# Altium schematic sheet MCU.SchDoc: MCU
size A4; Author: -; CompanyName: IOElectro; DrawnBy: Esmaeill M; Engineer: -; Organization: IOElectro; Address1: Bushehr,Iran; Address2: www.ioelectro.ir; DocumentNumber: 4; Revision: v0.1; SheetNumber: 4; SheetTotal: 6; ProjectNumber: 1013; Note: MCU
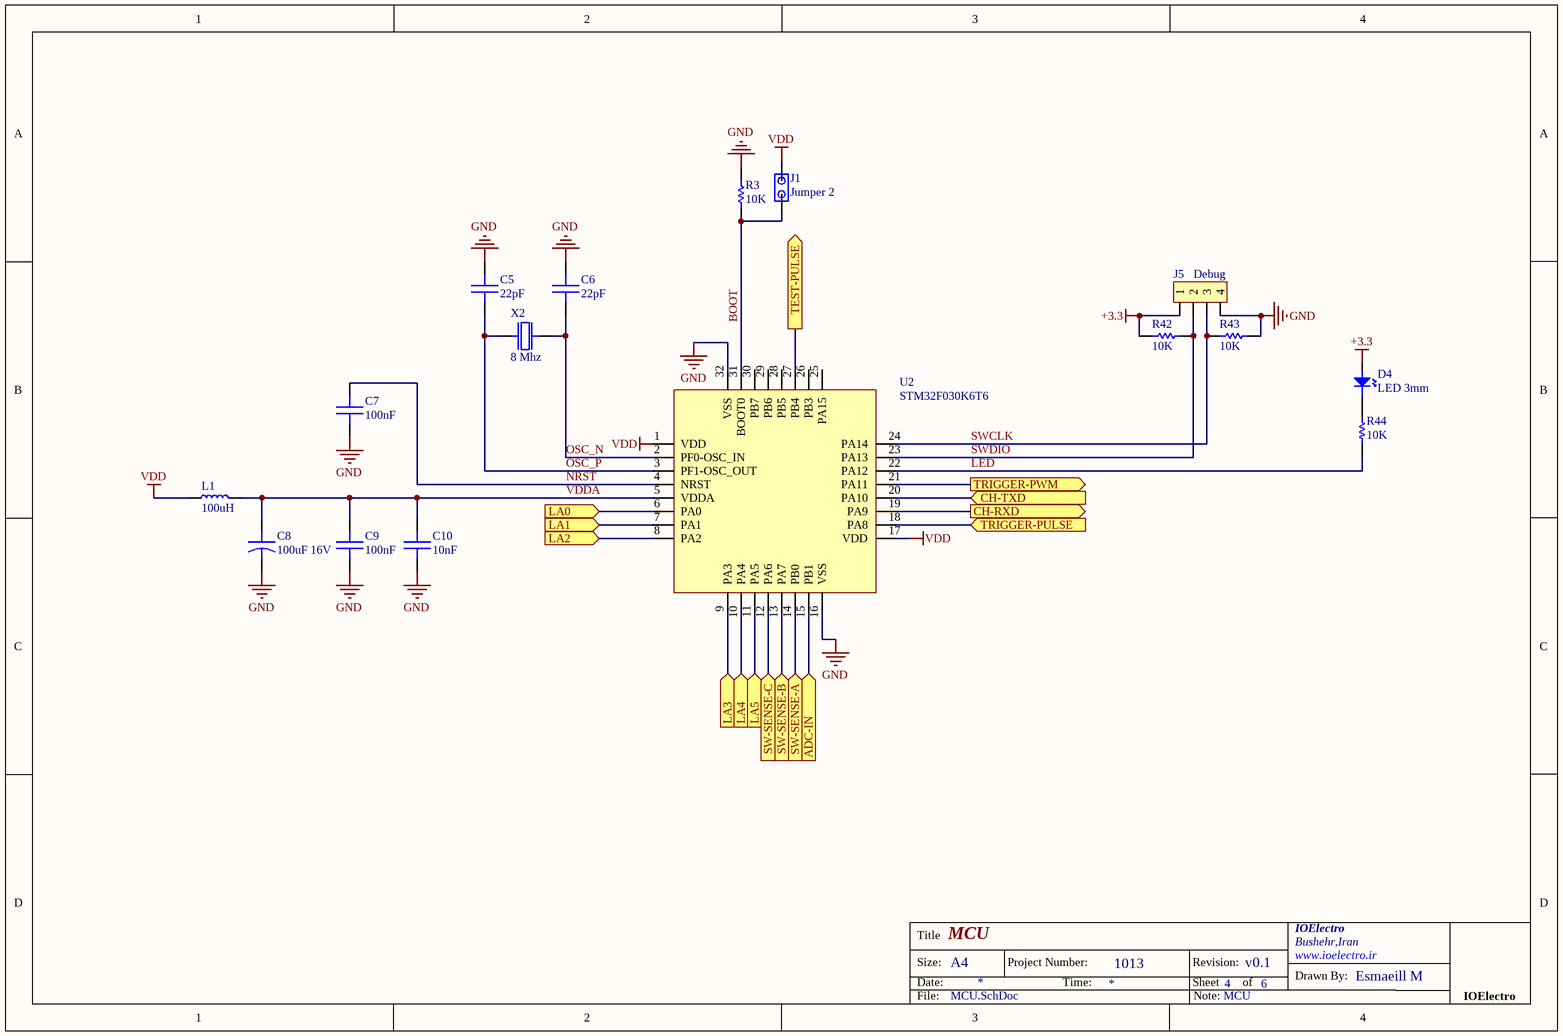
[diagram p0: MCU.SchDoc]

## Parts
C5  22pF  [C-0805]
C6  22pF  [C-0805]
C7  100nF  [C-0805]
C8  100uF 16V  [C-EL_6.5x7x2.5mm]
C9  100nF  [C-0805]
C10  10nF  [C-0805]
D4  LED 3mm  [LED-3MM]
J1  Jumper 2  [JAMPER-2-DIP_2.56mm]
J5  Debug  [PH-1X4]
L1  100uH  [L-DIP_3x7mm_pin9mm]
R3  10K  [R-0805]
R42  10K  [R-0805]
R43  10K  [R-0805]
R44  10K  [R-0805]
U2  STM32F030K6T6  [LQFP-32]
X2  8 Mhz  [XTAL-DIP_Small]

## Ports
ADC-IN (in), CH-RXD (out), CH-TXD (in), LA0 (in), LA1 (in), LA2 (in), LA3 (in), LA4 (in), LA5 (in), SW-SENSE-A (in), SW-SENSE-B (in), SW-SENSE-C (in), TEST-PULSE (out), TRIGGER-PULSE (in), TRIGGER-PWM (out)

## Nets
+3.3: D4.A J5.1 R42.1
GND: C5.2 C6.2 C7.2 C8.K C9.2 C10.2 J5.4 R3.2 R43.2 U2.16(VSS) U2.32(VSS)
VDD: J1.2 L1.1 U2.1(VDD) U2.17(VDD)
ADC-IN: U2.15(PB1) ; port ADC-IN
BOOT: J1.1 R3.1 U2.31(BOOT0)
CH-RXD: U2.19(PA9) ; port CH-RXD
CH-TXD: U2.20(PA10) ; port CH-TXD
LA0: U2.6(PA0) ; port LA0
LA1: U2.7(PA1) ; port LA1
LA2: U2.8(PA2) ; port LA2
LA3: U2.9(PA3) ; port LA3
LA4: U2.10(PA4) ; port LA4
LA5: U2.11(PA5) ; port LA5
LED: R44.2 U2.22(PA12)
NRST: C7.1 U2.4(NRST)
OSC_N: C6.1 U2.2(PF0-OSC_IN) X2.2
OSC_P: C5.1 U2.3(PF1-OSC_OUT) X2.1
SW-SENSE-A: U2.14(PB0) ; port SW-SENSE-A
SW-SENSE-B: U2.13(PA7) ; port SW-SENSE-B
SW-SENSE-C: U2.12(PA6) ; port SW-SENSE-C
SWCLK: J5.3 R43.1 U2.24(PA14)
SWDIO: J5.2 R42.2 U2.23(PA13)
TEST-PULSE: U2.27(PB4) ; port TEST-PULSE
TRIGGER-PULSE: U2.18(PA8) ; port TRIGGER-PULSE
TRIGGER-PWM: U2.21(PA11) ; port TRIGGER-PWM
VDDA: C8.A C9.1 C10.1 L1.2 U2.5(VDDA)
NetD4_K: D4.K R44.1

Not connected (* = marked no-connect by the designer): U2 25(PA15) 26(PB3) 28(PB5) 29(PB6) 30(PB7)

## Notes on the sheet
- Title
- Size:
- Date:
- A4
- Project Number:
- Time:
- Revision:
- Sheet
- of
- Drawn By:
- IOElectro
- File:
- Note:

## Library data of the parts
C5-C7 C9 C10 = CAP: SMD 0805
C8 = CAP-EL: CAPACITOR ELECTROLYTIC 6.3x7mm
D4 = LED
J1 = JUMPER-2: 2PIN DIP JAMPER 2.56mm
J5 = PH-1X4: PIN HEADER 1x4 2.56mm
L1 = AL0307-101K-LF: Axial Lead Inductors(Coils)For Signal Line 100uH 165mA
R3 R42-R44 = RES: 0805
U2 = STM32F030K6T6: STMICROELECTRONICS - STM32F030K6T6 - ARM MCU, Value Line, STM32 Family STM32F0 Series Microcontrollers, ARM Cortex-M0, 32bit, 48 MHz; Interface: I2C,SPI,UART,USART; Operating Supply Voltage: 3.3V; Data Bus Width: 32b; Memory Type: FLASH; Frequency: 48MHz; RAM Size: 4KB; Max Supply Voltage: 3.6V; Max Power Dissipation: 357mW; Number of I/Os: 26; Number of Timers/Counters: 5; Min Supply Voltage: 2.4V; Oscillator Type: Internal; Number of ADC Channels: 12; Number of SPI Channels: 1; Watchdog Timer: Yes; Memory Size: 32KB; Peripherals: POR,PWM,WDT,DMA; Supplier 1: Digi-Key; Manufacturer: STMicroelectronics; Manufacturer Part Number: STM32F030K6T6; RoHS: Yes; Category: Microcontrollers; Pricing 1: 1=1/84000, 10=1/65000, 25=1/55640, 80=1/32600, 250=1/24512, 500=1/08948, 1000=1/03760 (USD); Case/Package: LQFP; Number of Pins: 32; Weight: 0.027302oz; Contact Plating: Tin; Min Operating Temperature: -40°C; Max Operating Temperature: 85°C; Package Quantity: 250; Packaging: Tray; Core Architecture: ARM; Max Frequency: 48MHz; Number of I2C Channels: 1; Number of Programmable I/O: 26; Length: 7.2mm; Width: 7.2mm; Height: 1.45mm; Radiation Hardening: No; REACH SVHC: No SVHC; Lead Free: Lead Free; RoHS Compliant: Yes; ComponentLink1URL: https://datasheet.ciiva.com/29987/dm00088500-29987017.pdf?src-supplier=Avnet; ComponentLink1Description: https://datasheet.ciiva.com/29987/dm00088500-29987017.pdf?src-supplier=Avnet; ComponentLink2URL: https://datasheet.ciiva.com/46427/1792126-46427291.pdf?src-supplier=Element14; ComponentLink2Description: https://datasheet.ciiva.com/46427/1792126-46427291.pdf?src-supplier=Element14; Supplier Part Number 1: 497-14046-ND
X2 = XTAL: Crystal oscillator